# EAGLE schematic Main Board Schematic v5 (EAGLE 9.7.0)
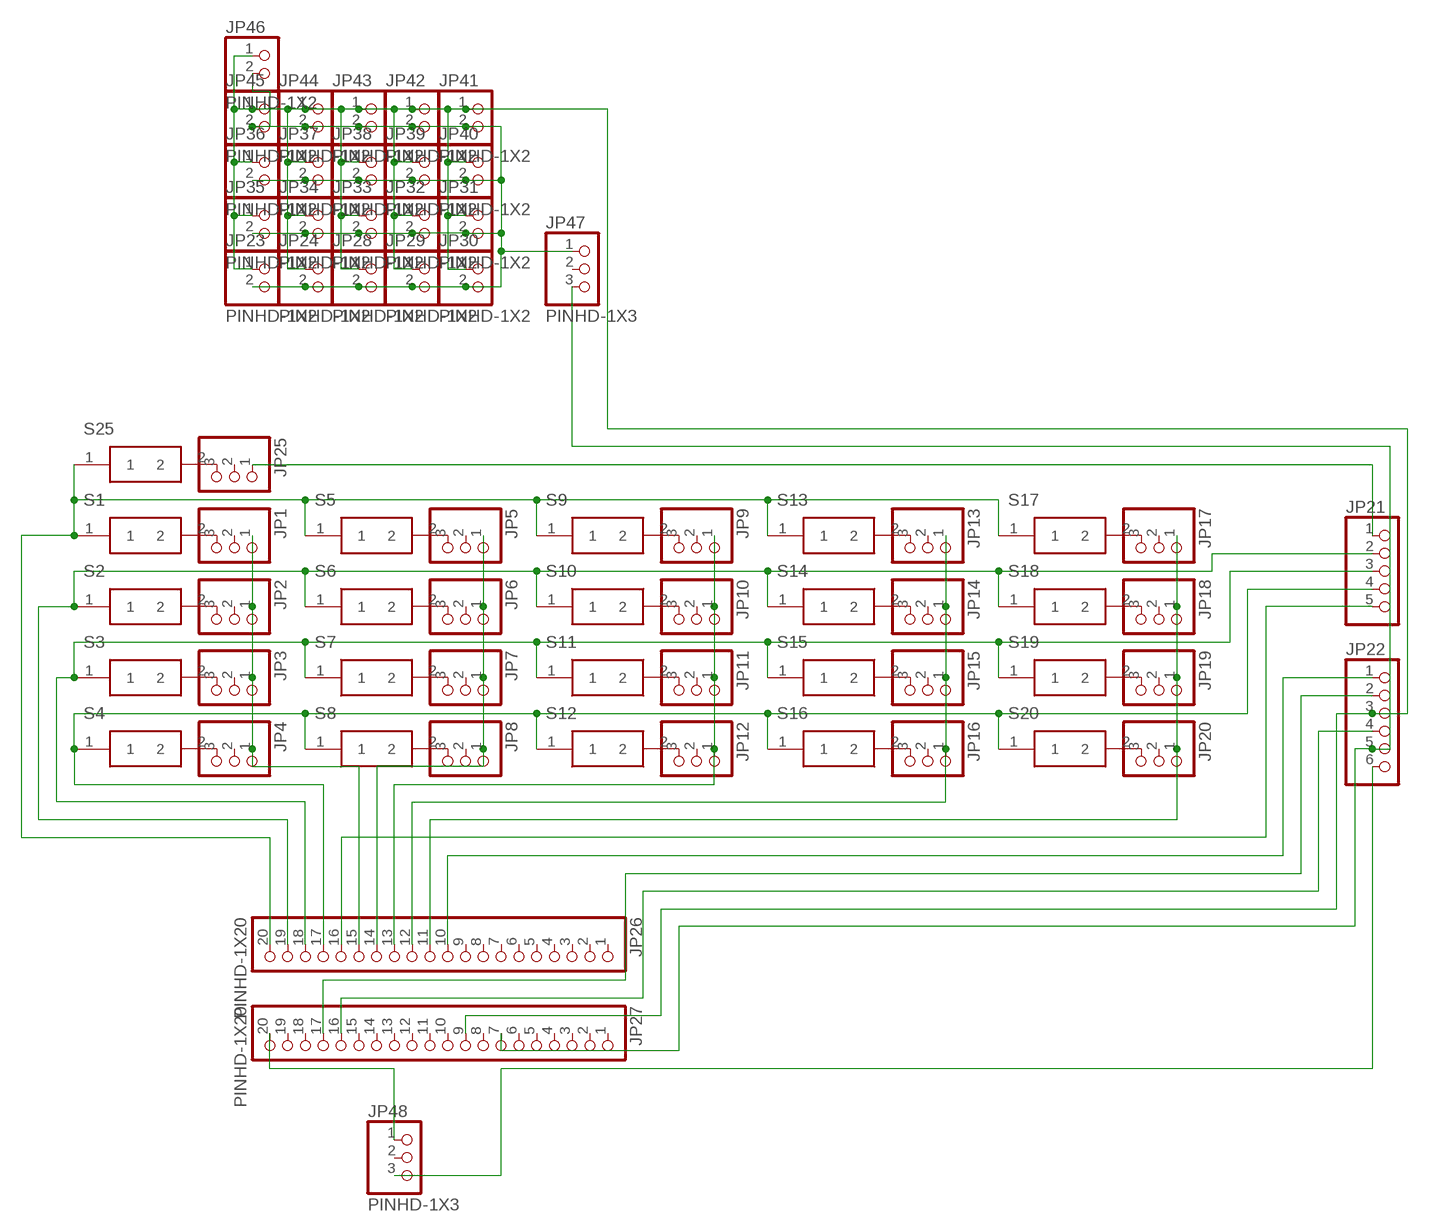
[diagram p0: schematic, sheet 1]

## Parts
JP1  PINHD-1X3  [1X03]
JP2  PINHD-1X3  [1X03]
JP3  PINHD-1X3  [1X03]
JP4  PINHD-1X3  [1X03]
JP5  PINHD-1X3  [1X03]
JP6  PINHD-1X3  [1X03]
JP7  PINHD-1X3  [1X03]
JP8  PINHD-1X3  [1X03]
JP9  PINHD-1X3  [1X03]
JP10  PINHD-1X3  [1X03]
JP11  PINHD-1X3  [1X03]
JP12  PINHD-1X3  [1X03]
JP13  PINHD-1X3  [1X03]
JP14  PINHD-1X3  [1X03]
JP15  PINHD-1X3  [1X03]
JP16  PINHD-1X3  [1X03]
JP17  PINHD-1X3  [1X03]
JP18  PINHD-1X3  [1X03]
JP19  PINHD-1X3  [1X03]
JP20  PINHD-1X3  [1X03]
JP21  PINHD-1X5  [1X05]
JP22  PINHD-1X6  [1X06]
JP23  PINHD-1X2  [1X02]
JP24  PINHD-1X2  [1X02]
JP25  PINHD-1X3  [1X03]
JP26  PINHD-1X20  [1X20]
JP27  PINHD-1X20  [1X20]
JP28  PINHD-1X2  [1X02]
JP29  PINHD-1X2  [1X02]
JP30  PINHD-1X2  [1X02]
JP31  PINHD-1X2  [1X02]
JP32  PINHD-1X2  [1X02]
JP33  PINHD-1X2  [1X02]
JP34  PINHD-1X2  [1X02]
JP35  PINHD-1X2  [1X02]
JP36  PINHD-1X2  [1X02]
JP37  PINHD-1X2  [1X02]
JP38  PINHD-1X2  [1X02]
JP39  PINHD-1X2  [1X02]
JP40  PINHD-1X2  [1X02]
JP41  PINHD-1X2  [1X02]
JP42  PINHD-1X2  [1X02]
JP43  PINHD-1X2  [1X02]
JP44  PINHD-1X2  [1X02]
JP45  PINHD-1X2  [1X02]
JP46  PINHD-1X2  [1X02]
JP47  PINHD-1X3  [1X03]
JP48  PINHD-1X3  [1X03]
S1  MX1A-E1NW  [MX1AE1NW]
S2  MX1A-E1NW  [MX1AE1NW]
S3  MX1A-E1NW  [MX1AE1NW]
S4  MX1A-E1NW  [MX1AE1NW]
S5  MX1A-E1NW  [MX1AE1NW]
S6  MX1A-E1NW  [MX1AE1NW]
S7  MX1A-E1NW  [MX1AE1NW]
S8  MX1A-E1NW  [MX1AE1NW]
S9  MX1A-E1NW  [MX1AE1NW]
S10  MX1A-E1NW  [MX1AE1NW]
S11  MX1A-E1NW  [MX1AE1NW]
S12  MX1A-E1NW  [MX1AE1NW]
S13  MX1A-E1NW  [MX1AE1NW]
S14  MX1A-E1NW  [MX1AE1NW]
S15  MX1A-E1NW  [MX1AE1NW]
S16  MX1A-E1NW  [MX1AE1NW]
S17  MX1A-E1NW  [MX1AE1NW]
S18  MX1A-E1NW  [MX1AE1NW]
S19  MX1A-E1NW  [MX1AE1NW]
S20  MX1A-E1NW  [MX1AE1NW]
S25  MX1A-E1NW  [MX1AE1NW]

## Nets
N$1: JP1.3 S1.2
N$2: JP2.3 S2.2
N$3: JP3.3 S3.2
N$4: JP4.3 S4.2
N$5: JP5.3 S5.2
N$6: JP6.3 S6.2
N$7: JP7.3 S7.2
N$8: JP8.3 S8.2
N$9: JP9.3 S9.2
N$10: JP10.3 S10.2
N$11: JP11.3 S11.2
N$12: JP12.3 S12.2
N$13: JP13.3 S13.2
N$14: JP14.3 S14.2
N$15: JP15.3 S15.2
N$16: JP16.3 S16.2
N$17: JP17.3 S17.2
N$18: JP18.3 S18.2
N$19: JP19.3 S19.2
N$20: JP20.3 S20.2
N$21: JP21.1 JP25.1
N$22: JP21.5 JP26.16
N$23: JP22.1 JP26.10
N$24: JP22.6 JP48.3
N$25: JP25.3 S25.2
N$26: JP1.1 JP2.1 JP3.1 JP4.1 JP26.15
N$27: JP5.1 JP6.1 JP7.1 JP8.1 JP26.14
N$28: JP9.1 JP10.1 JP11.1 JP12.1 JP26.13
N$29: JP13.1 JP14.1 JP15.1 JP16.1 JP26.12
N$30: JP17.1 JP18.1 JP19.1 JP20.1 JP26.11
N$31: JP22.2 JP27.17
N$32: JP21.4 JP26.17 S4.1 S8.1 S12.1 S16.1 S20.1
N$33: JP21.3 JP26.18 S3.1 S7.1 S11.1 S15.1 S19.1
N$34: JP21.2 JP26.19 S2.1 S6.1 S10.1 S14.1 S18.1
N$35: JP26.20 S1.1 S5.1 S9.1 S13.1 S17.1 S25.1
N$36: JP22.4 JP27.16
N$37: JP22.3 JP23.1 JP24.1 JP27.9 JP28.1 JP29.1 JP30.1 JP31.1 JP32.1 JP33.1 JP34.1 JP35.1 JP36.1 JP37.1 JP38.1 JP39.1 JP40.1 JP41.1 JP42.1 JP43.1 JP44.1 JP45.1 JP46.1
N$38: JP22.5 JP27.7 JP47.3
N$39: JP23.2 JP24.2 JP28.2 JP29.2 JP30.2 JP31.2 JP32.2 JP33.2 JP34.2 JP35.2 JP36.2 JP37.2 JP38.2 JP39.2 JP40.2 JP41.2 JP42.2 JP43.2 JP44.2 JP45.2 JP46.2 JP47.1
N$40: JP27.20 JP48.1
Unconnected: JP1.2 JP2.2 JP3.2 JP4.2 JP5.2 JP6.2 JP7.2 JP8.2 JP9.2 JP10.2 JP11.2 JP12.2 JP13.2 JP14.2 JP15.2 JP16.2 JP17.2 JP18.2 JP19.2 JP20.2 JP25.2 JP26.1 JP26.2 JP26.3 JP26.4 JP26.5 JP26.6 JP26.7 JP26.8 JP26.9 JP27.1 JP27.2 JP27.3 JP27.4 JP27.5 JP27.6 JP27.8 JP27.10 JP27.11 JP27.12 JP27.13 JP27.14 JP27.15 JP27.18 JP27.19 JP47.2 JP48.2

## Library data of the parts
JP1-JP20 JP25 JP47 JP48 = Connector:PINHD-1X3: PIN HEADER; CATEGORY: CONNECTOR; SUB-CATEGORY: PIN-HEADER
JP21 = Connector:PINHD-1X5: PIN HEADER; CATEGORY: CONNECTOR; SUB-CATEGORY: PIN-HEADER
JP22 = Connector:PINHD-1X6: PIN HEADER; CATEGORY: CONNECTOR; SUB-CATEGORY: PIN-HEADER
JP23 JP24 JP28-JP46 = Connector:PINHD-1X2: PIN HEADER; CATEGORY: CONNECTOR; SUB-CATEGORY: PIN-HEADER
JP26 JP27 = Connector:PINHD-1X20: PIN HEADER; CATEGORY: CONNECTOR; SUB-CATEGORY: PIN-HEADER
S1-S20 S25 = SamacSys_Parts:MX1A-E1NW: Pushbutton Switches Full Travel, Mech. Keyswitch, Click Tactile Feel (Blue stem), 60cN, No LED, No Diode, Fixation Pins for PCB Mounting Source: Datasheet <https://media.digikey.com/pdf/Data Sheets/Cherry PDFs/MX Series.pdf>; DESCRIPTION: Pushbutton Switches Full Travel, Mech. Keyswitch, Click Tactile Feel (Blue stem), 60cN, No LED, No Diode, Fixation Pins for PCB Mounting; HEIGHT: 15.2mm; MANUFACTURER_NAME: Cherry; MANUFACTURER_PART_NUMBER: MX1A-E1NW; MOUSER_PART_NUMBER: 540-MX1A-E1NW; MOUSER_PRICE-STOCK: https://www.mouser.co.uk/ProductDetail/CHERRY/MX1A-E1NW/?qs=Z7NFYKyvgJd45Wm4xzFv7w%3D%3D